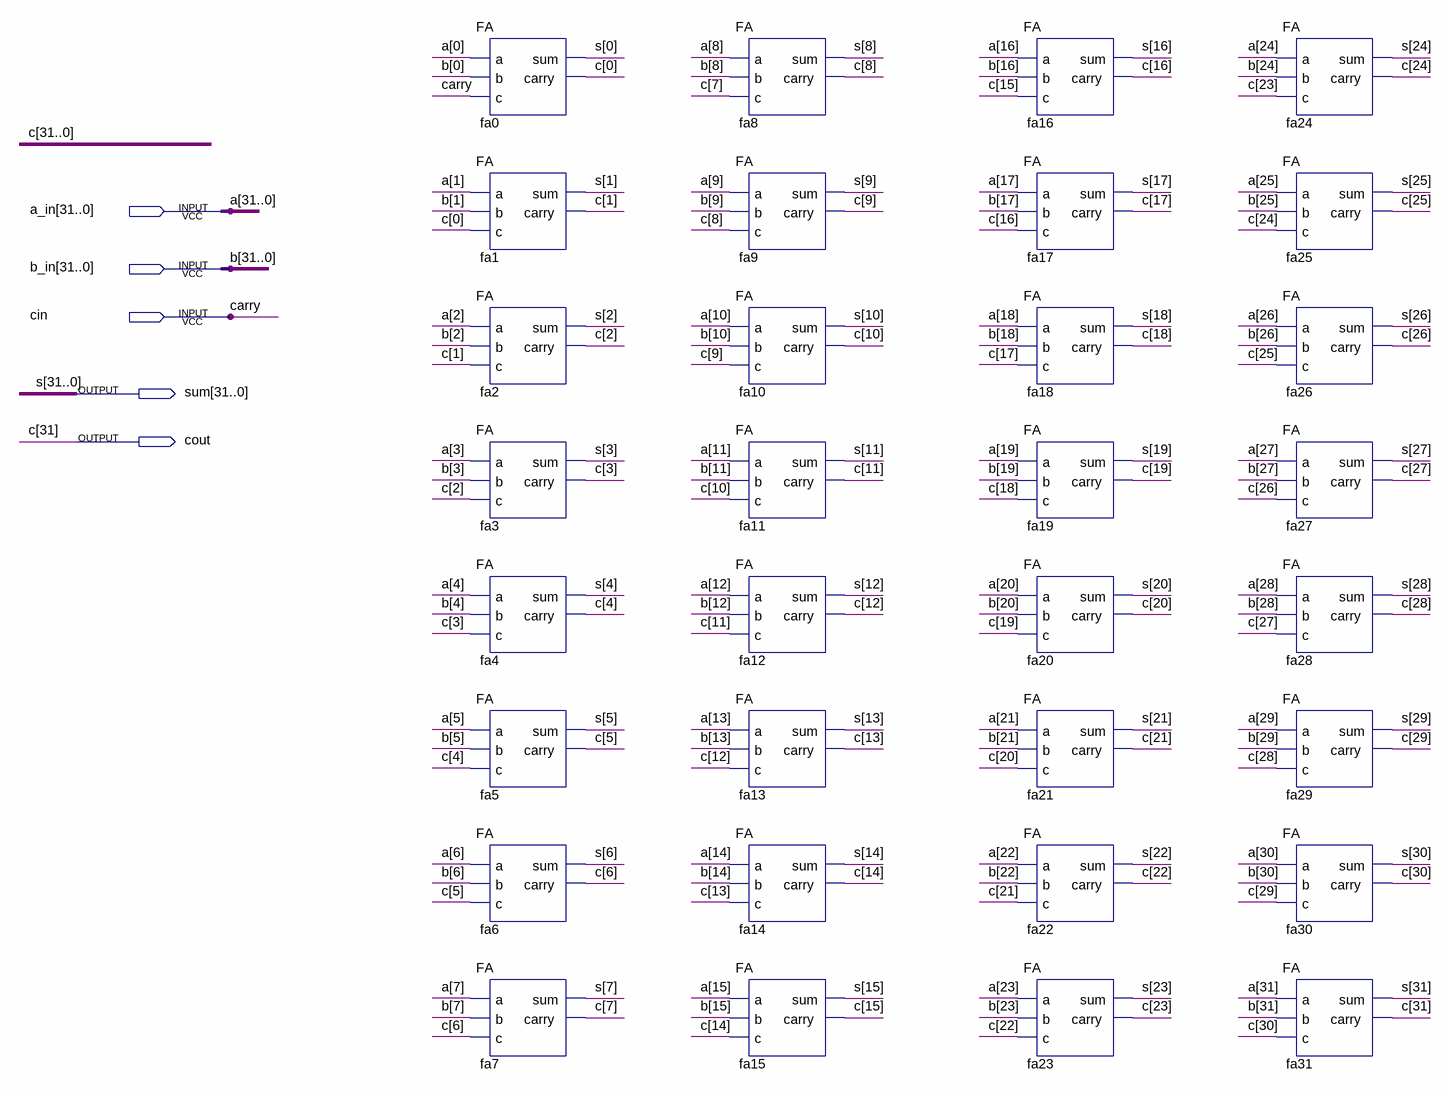
[diagram p0: schematic sheet]
// Quartus schematic Adder.bdf as structural Verilog: 32 symbols, 5 pins
module Adder (
  input  [31:0] a_in,
  input  [31:0] b_in,
  input  cin,
  output [31:0] sum,
  output cout
);

  wire [30:0] c;

  FA fa0 (.a(a_in[0]), .b(b_in[0]), .c(cin), .sum(sum[0]), .carry(c[0]));
  FA fa1 (.a(a_in[1]), .b(b_in[1]), .c(c[0]), .sum(sum[1]), .carry(c[1]));
  FA fa2 (.a(a_in[2]), .b(b_in[2]), .c(c[1]), .sum(sum[2]), .carry(c[2]));
  FA fa3 (.a(a_in[3]), .b(b_in[3]), .c(c[2]), .sum(sum[3]), .carry(c[3]));
  FA fa4 (.a(a_in[4]), .b(b_in[4]), .c(c[3]), .sum(sum[4]), .carry(c[4]));
  FA fa5 (.a(a_in[5]), .b(b_in[5]), .c(c[4]), .sum(sum[5]), .carry(c[5]));
  FA fa6 (.a(a_in[6]), .b(b_in[6]), .c(c[5]), .sum(sum[6]), .carry(c[6]));
  FA fa7 (.a(a_in[7]), .b(b_in[7]), .c(c[6]), .sum(sum[7]), .carry(c[7]));
  FA fa8 (.a(a_in[8]), .b(b_in[8]), .c(c[7]), .sum(sum[8]), .carry(c[8]));
  FA fa9 (.a(a_in[9]), .b(b_in[9]), .c(c[8]), .sum(sum[9]), .carry(c[9]));
  FA fa10 (.a(a_in[10]), .b(b_in[10]), .c(c[9]), .sum(sum[10]), .carry(c[10]));
  FA fa11 (.a(a_in[11]), .b(b_in[11]), .c(c[10]), .sum(sum[11]), .carry(c[11]));
  FA fa12 (.a(a_in[12]), .b(b_in[12]), .c(c[11]), .sum(sum[12]), .carry(c[12]));
  FA fa13 (.a(a_in[13]), .b(b_in[13]), .c(c[12]), .sum(sum[13]), .carry(c[13]));
  FA fa14 (.a(a_in[14]), .b(b_in[14]), .c(c[13]), .sum(sum[14]), .carry(c[14]));
  FA fa15 (.a(a_in[15]), .b(b_in[15]), .c(c[14]), .sum(sum[15]), .carry(c[15]));
  FA fa16 (.a(a_in[16]), .b(b_in[16]), .c(c[15]), .sum(sum[16]), .carry(c[16]));
  FA fa17 (.a(a_in[17]), .b(b_in[17]), .c(c[16]), .sum(sum[17]), .carry(c[17]));
  FA fa18 (.a(a_in[18]), .b(b_in[18]), .c(c[17]), .sum(sum[18]), .carry(c[18]));
  FA fa19 (.a(a_in[19]), .b(b_in[19]), .c(c[18]), .sum(sum[19]), .carry(c[19]));
  FA fa20 (.a(a_in[20]), .b(b_in[20]), .c(c[19]), .sum(sum[20]), .carry(c[20]));
  FA fa21 (.a(a_in[21]), .b(b_in[21]), .c(c[20]), .sum(sum[21]), .carry(c[21]));
  FA fa22 (.a(a_in[22]), .b(b_in[22]), .c(c[21]), .sum(sum[22]), .carry(c[22]));
  FA fa23 (.a(a_in[23]), .b(b_in[23]), .c(c[22]), .sum(sum[23]), .carry(c[23]));
  FA fa24 (.a(a_in[24]), .b(b_in[24]), .c(c[23]), .sum(sum[24]), .carry(c[24]));
  FA fa25 (.a(a_in[25]), .b(b_in[25]), .c(c[24]), .sum(sum[25]), .carry(c[25]));
  FA fa26 (.a(a_in[26]), .b(b_in[26]), .c(c[25]), .sum(sum[26]), .carry(c[26]));
  FA fa27 (.a(a_in[27]), .b(b_in[27]), .c(c[26]), .sum(sum[27]), .carry(c[27]));
  FA fa28 (.a(a_in[28]), .b(b_in[28]), .c(c[27]), .sum(sum[28]), .carry(c[28]));
  FA fa29 (.a(a_in[29]), .b(b_in[29]), .c(c[28]), .sum(sum[29]), .carry(c[29]));
  FA fa30 (.a(a_in[30]), .b(b_in[30]), .c(c[29]), .sum(sum[30]), .carry(c[30]));
  FA fa31 (.a(a_in[31]), .b(b_in[31]), .c(c[30]), .sum(sum[31]), .carry(cout));

  // Other names for the same wires on the sheet: a[31:0] = a_in; b[31:0] = b_in; c[31] = cout; carry = cin;
  //   s[31:0] = sum
endmodule
